# Altium schematic sheet [4]Communicate.SchDoc
size A
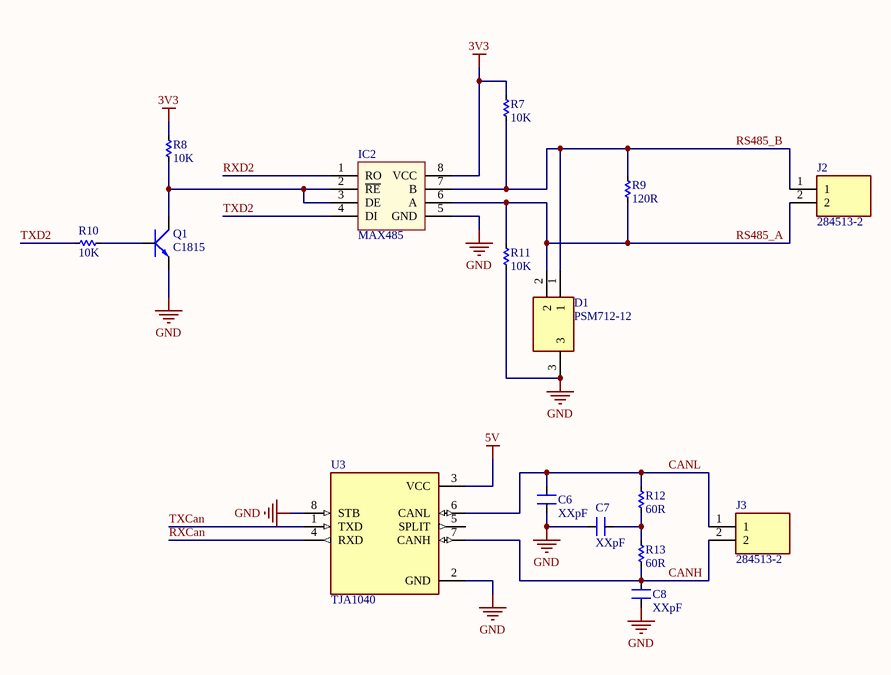
[diagram p0: [4]Communicate.SchDoc]

## Parts
C6  XXpF  [CN-SMD-0805]
C7  XXpF  [CN-SMD-0805]
C8  XXpF  [CN-SMD-0805]
D1  PSM712-12  [PSM71212]
IC2  MAX485  [SO8]
J2  284513-2  [SHDRRA2W80P0X381_1X2_863X920X730P]
J3  284513-2  [SHDRRA2W80P0X381_1X2_863X920X730P]
Q1  C1815  [SOT23B]
R7  10K  [RES-SMD-0805]
R8  10K  [RES-SMD-0805]
R9  120R  [RES-SMD-0805]
R10  10K  [RES-SMD-0805]
R11  10K  [RES-SMD-0805]
R12  60R  [RES-SMD-0805]
R13  60R  [RES-SMD-0805]
U3  TJA1040  [SOIC127P600X175-8N]

## Nets
3V3: IC2.8(VCC) R7.2 R8.2
5V: U3.3(VCC)
GND: C6.1 C7.1 C8.1 D1.3 IC2.5(GND) Q1.1(E) R11.1 U3.2(GND) U3.8(STB)
CANH: C8.2 J3.2 R13.2 U3.7(CANH)
CANL: C6.2 J3.1 R12.1 U3.6(CANL)
RS485_A: D1.2 IC2.6(A) J2.2 R9.1 R11.2
RS485_B: D1.1 IC2.7(B) J2.1 R7.1 R9.2
RXCan: U3.4(RXD)
RXD2: IC2.1(RO)
TXCan: U3.1(TXD)
TXD2: IC2.4(DI) R10.1
NetC7_2: C7.2 R12.2 R13.1
NetIC2_2: IC2.2(~{RE}) IC2.3(DE) Q1.2(C) R8.1
NetQ1_3: Q1.3(B) R10.2

Not connected (* = marked no-connect by the designer): U3 5(SPLIT)

## Library data of the parts
C6-C8 = CN: Value: 33pF
D1 = PSM712-12: TVS Diode (Bi-directional); Manufacturer_Name: ProTek Devices; Datasheet Link: http://www.protekdevices.com/xyz/documents/datasheets/psm712.pdf; Height: 1.21mm; Manufacturer_Part_Number: PSM712-12
IC2 = MAX485: RS232 - RS485 (Same sn75176)
J2 J3 = 284513-2: Connector; Manufacturer_Name: TE Connectivity; Datasheet Link: https://www.te.com/commerce/DocumentDelivery/DDEController?Action=showdoc&DocId=Catalog+Section%7F1308389_EUROSTYLE_TERMINAL_BLOCKS%7F0607%7Fpdf%7FEnglish%7FENG_CS_1308389_EUROSTYLE_TERMINAL_BLOCKS_0607.pdf%7F284513-2; Height: 7.3mm; Manufacturer_Part_Number: 284513-2; Mouser Part Number: 571-284513-2; Mouser Price/Stock: https://www.mouser.co.uk/ProductDetail/TE-Connectivity/284513-2?qs=woBvfblj%2FzzKKzHe5cbw%252BQ%3D%3D; Arrow Part Number: 284513-2; Arrow Price/Stock: https://www.arrow.com/en/products/284513-2/te-connectivity
Q1 = C1815: NPN 600mW, ECB; Value: C1815
R7-R13 = Res-SMD: Resistor; Manufacturer: Generic Components; Class: Passive; Published: 08/06/2000; Publisher: Altium Hobart Technology Centre
U3 = TJA1040: 1/1 Transceiver Half CANbus 8-SO; MF: NXP USA; Package: SOIC-8 NXP USA; SnapEDA_Link: https://www.snapeda.com/parts/TJA1040/NXP%20USA%20Inc./view-part/563351/?ref=snap; Price: None; Availability: Unavailable; MP: TJA1040; Value: *